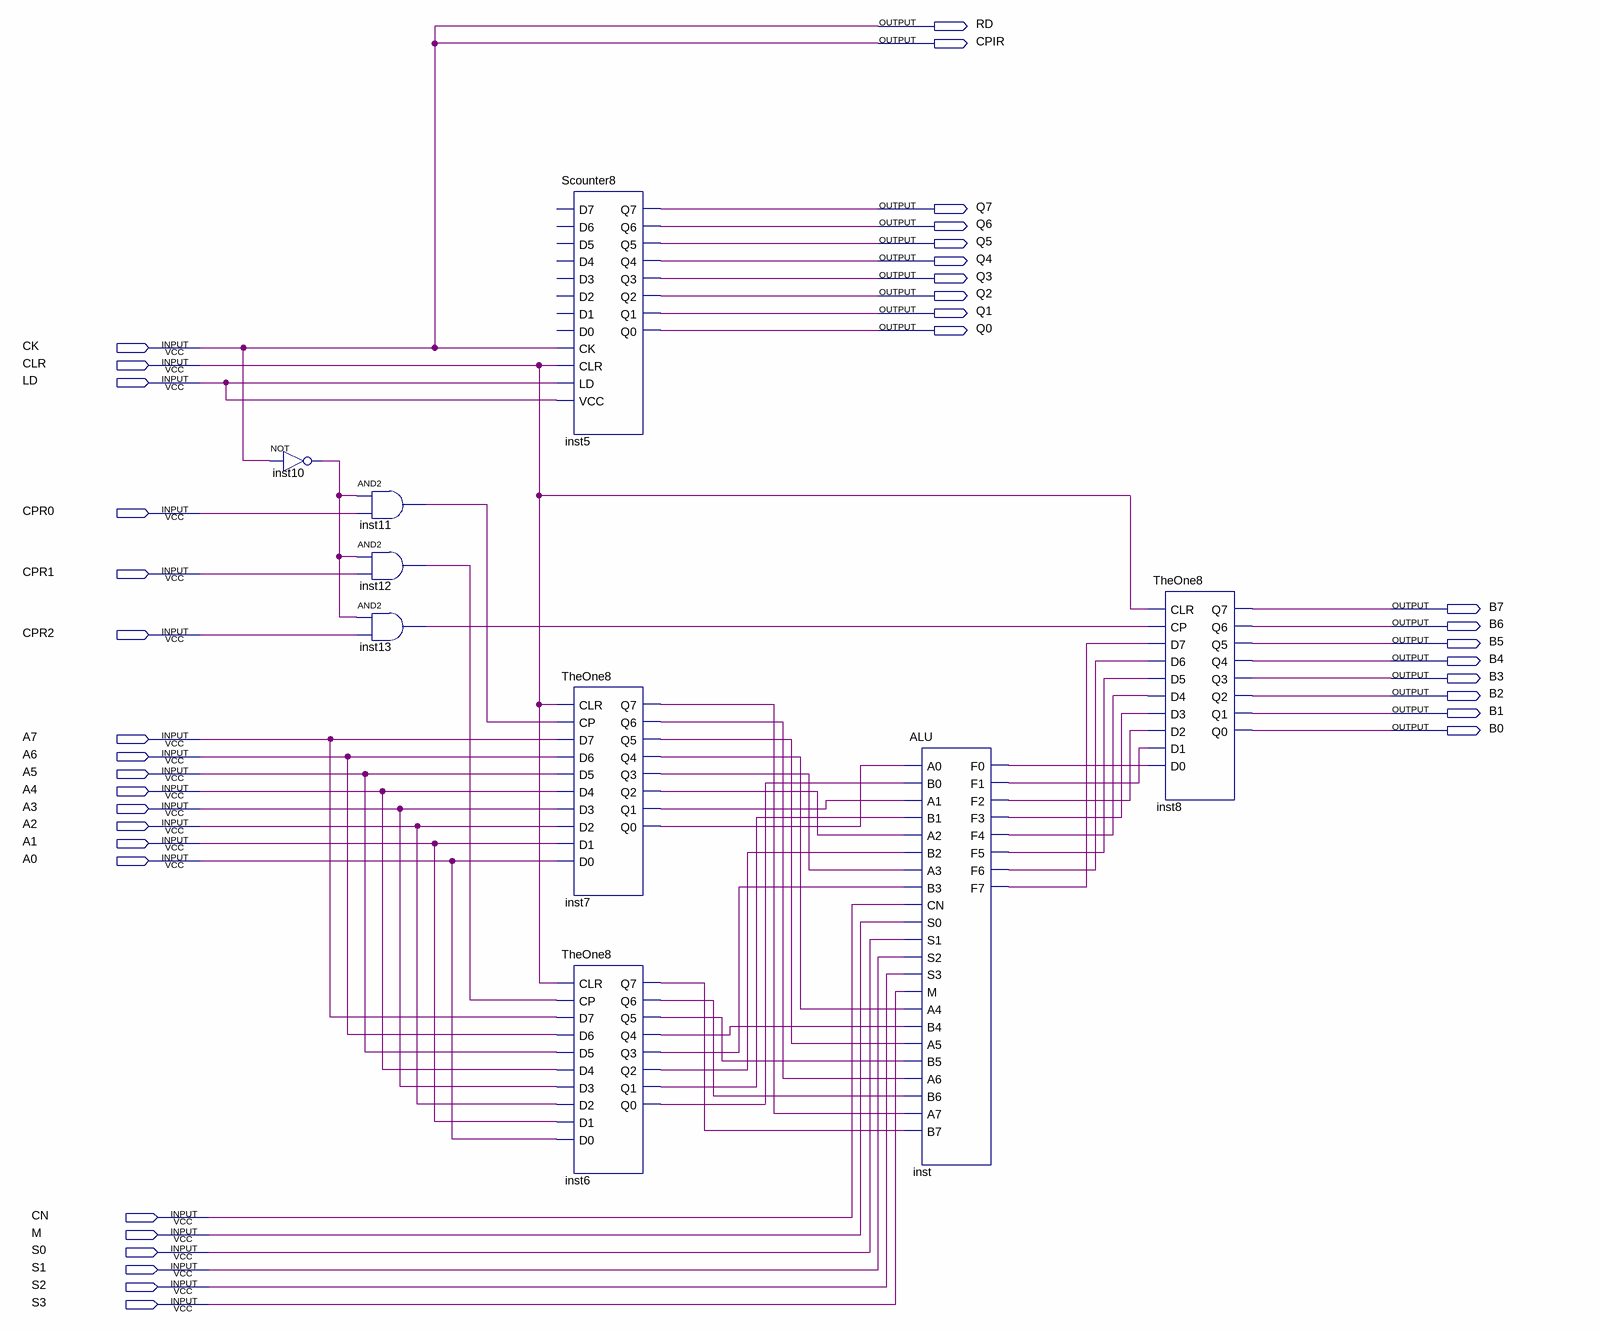
[diagram p0: schematic sheet]
// Quartus schematic SmallProgram.bdf as structural Verilog: 9 symbols, 38 pins
module SmallProgram (
  input  CK,
  input  CLR,
  input  LD,
  input  CPR0,
  input  CPR1,
  input  CPR2,
  input  A7,
  input  A6,
  input  A5,
  input  A4,
  input  A3,
  input  A2,
  input  A1,
  input  A0,
  input  CN,
  input  M,
  input  S0,
  input  S1,
  input  S2,
  input  S3,
  output RD,
  output CPIR,
  output Q7,
  output Q6,
  output Q5,
  output Q4,
  output Q3,
  output Q2,
  output Q1,
  output Q0,
  output B7,
  output B6,
  output B5,
  output B4,
  output B3,
  output B2,
  output B1,
  output B0
);

  wire inst6_q0, inst6_q1, inst6_q2, inst6_q3, inst6_q4, inst6_q5, inst6_q6, inst6_q7, inst7_q0, inst7_q1,
       inst7_q2, inst7_q3, inst7_q4, inst7_q5, inst7_q6, inst7_q7, inst10_out, inst11_out, inst12_out,
       inst13_out, inst_f0, inst_f1, inst_f2, inst_f3, inst_f4, inst_f5, inst_f6, inst_f7;

  not inst10 (inst10_out, CK);
  and inst11 (inst11_out, inst10_out, CPR0);
  and inst12 (inst12_out, inst10_out, CPR1);
  and inst13 (inst13_out, inst10_out, CPR2);
  Scounter8 inst5 (
    .CK(CK), .CLR(CLR), .LD(LD), .VCC(LD), .Q7(Q7), .Q6(Q6), .Q5(Q5), .Q4(Q4), .Q3(Q3), .Q2(Q2), .Q1(Q1),
    .Q0(Q0));  // open: D7, D6, D5, D4, D3, D2, D1, D0
  TheOne8 inst7 (
    .CLR(CLR), .CP(inst11_out), .D7(A7), .D6(A6), .D5(A5), .D4(A4), .D3(A3), .D2(A2), .D1(A1), .D0(A0),
    .Q7(inst7_q7), .Q6(inst7_q6), .Q5(inst7_q5), .Q4(inst7_q4), .Q3(inst7_q3), .Q2(inst7_q2), .Q1(inst7_q1),
    .Q0(inst7_q0));
  TheOne8 inst6 (
    .CLR(CLR), .CP(inst12_out), .D7(A7), .D6(A6), .D5(A5), .D4(A4), .D3(A3), .D2(A2), .D1(A1), .D0(A0),
    .Q7(inst6_q7), .Q6(inst6_q6), .Q5(inst6_q5), .Q4(inst6_q4), .Q3(inst6_q3), .Q2(inst6_q2), .Q1(inst6_q1),
    .Q0(inst6_q0));
  ALU inst (
    .A0(inst7_q0), .B0(inst6_q0), .A1(inst7_q1), .B1(inst6_q1), .A2(inst7_q2), .B2(inst6_q2), .A3(inst7_q3),
    .B3(inst6_q3), .CN(CN), .S0(M), .S1(S0), .S2(S1), .S3(S2), .M(S3), .A4(inst7_q4), .B4(inst6_q4),
    .A5(inst7_q5), .B5(inst6_q5), .A6(inst7_q6), .B6(inst6_q6), .A7(inst7_q7), .B7(inst6_q7), .F0(inst_f0),
    .F1(inst_f1), .F2(inst_f2), .F3(inst_f3), .F4(inst_f4), .F5(inst_f5), .F6(inst_f6), .F7(inst_f7));
  TheOne8 inst8 (
    .CLR(CLR), .CP(inst13_out), .D7(inst_f7), .D6(inst_f6), .D5(inst_f5), .D4(inst_f4), .D3(inst_f3),
    .D2(inst_f2), .D1(inst_f1), .D0(inst_f0), .Q7(B7), .Q6(B6), .Q5(B5), .Q4(B4), .Q3(B3), .Q2(B2), .Q1(B1),
    .Q0(B0));

  assign CPIR = CK;
  assign RD = CK;
endmodule
